# EasyEDA Pro project ProProject_Mini-Cube_2024-04-10.epro, board PCB2
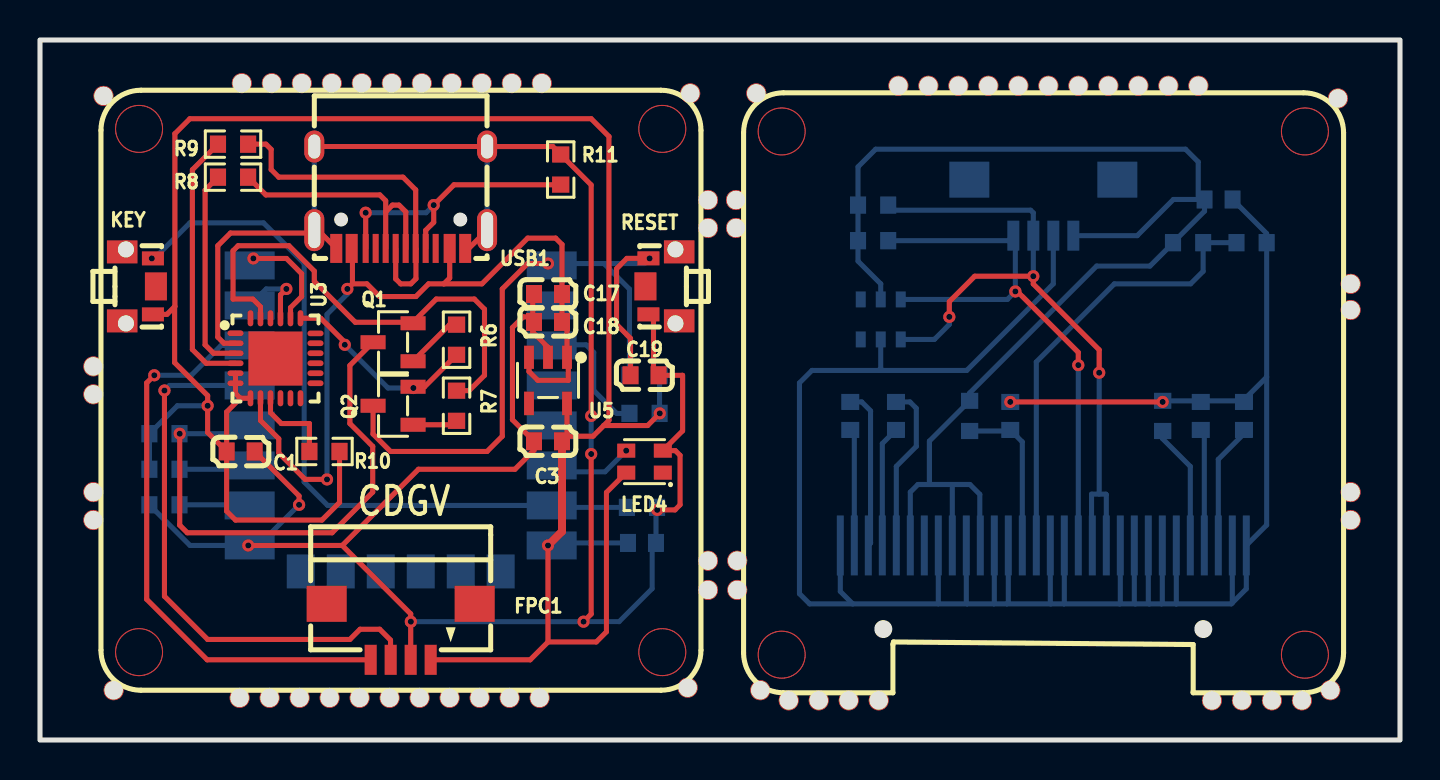
[diagram p3: board, top side]
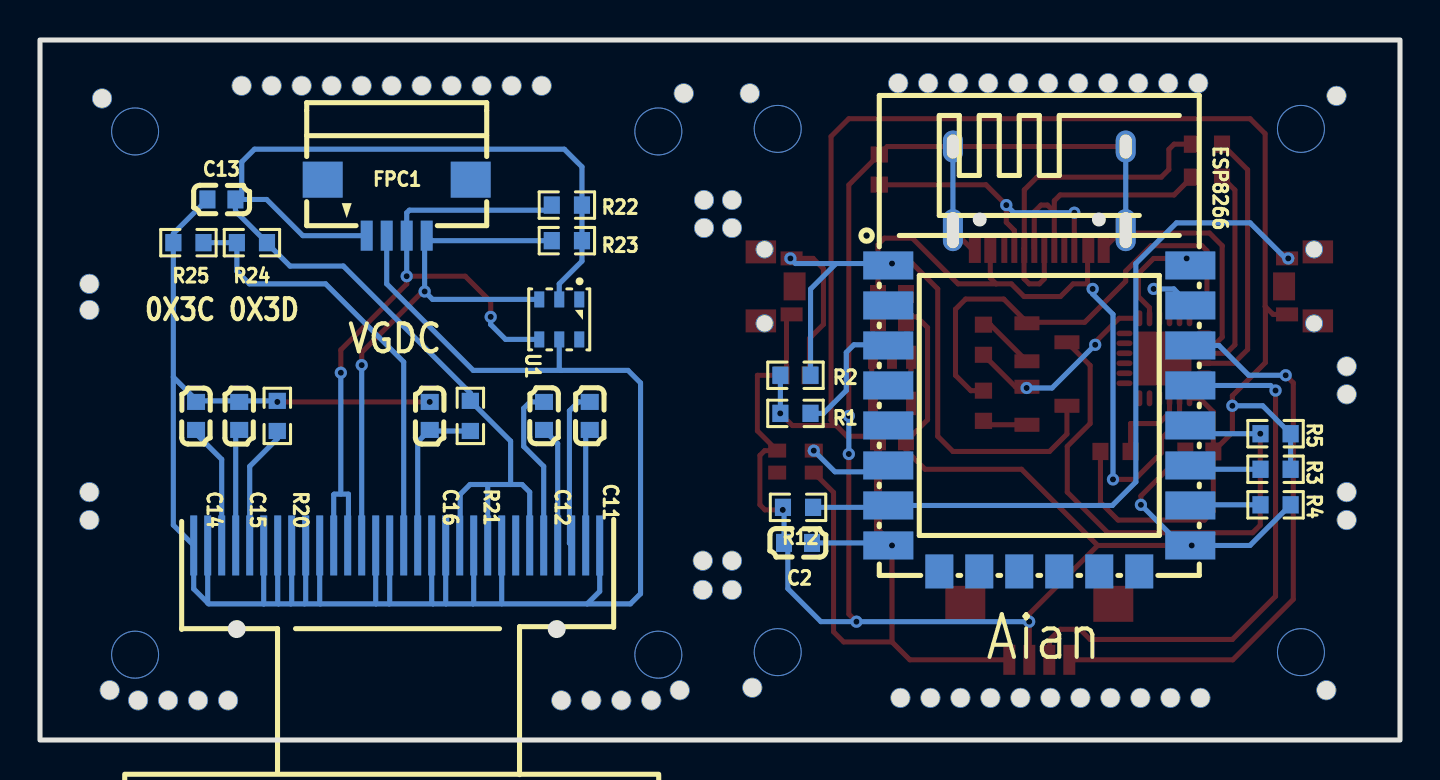
[diagram p4: board, bottom side, seen from below]

Outline 68 x 35 mm; copper layers: Top Layer, Bottom Layer. Coordinates in mm from the lower left corner of the outline.
Outline path: rectangle 0,35 68,0
Stack: Top Layer 0.035mm / Dielectric1 1.51mm FR4 er 4.5 / Bottom Layer 0.035mm

## Design rules (mm)
template: JLCPCB Capability(Two Layers Board)
spacing copperThickness1oz (default): track to track 0.102, other pairs 0.152 to 0.3
spacing copperThickness2oz: track to track 0.203, other pairs 0.152 to 0.3
track width copperThickness1oz (default): min 0.127, default 0.254, max 2.54
track width copperThickness2oz: min 0.203, default 0.254, max 2.54
differential pair differentialPair (default): width min 0.127, default 0.254, max 2.54; gap min 0.152, default 0.152
via viaSize (default): diameter min 0.5, default 0.61, max 10; hole min 0.3, default 0.305, max 6.3

## Placement (name value [footprint] x y rotation side)
C1  100nF  [C0603]  10.03 14.43 180 top
C2  100nF  [C0603]  30.1 9.85 180 bottom
C3  100nF  [C0603]  25.4 14.93 0 top
C11  100nF  [C0603]  40.51 16.2 270 bottom
C12  100nF  [C0603]  42.8 16.2 270 bottom
C13  100nF  [C0603]  58.93 27.03 0 bottom
C14  2.2UF  [C0603]  60.2 16.2 90 bottom
C15  4.7UF  [C0603]  58.04 16.2 90 bottom
C16  100nF  [C0603]  48.51 16.2 90 bottom
C17  100nF  [C0603]  25.4 22.3 0 top
C18  1UF  [C0603]  25.4 20.9 0 top
C19  100nF  [C0603]  30.23 18.24 0 top
ESP8266  2.4GHz  [WIFIM-SMD_ESP-12F-ESP8266MOD]  18.03 16.08 270 bottom
FPC1  -  [FFC-SMD_FFC10032-04SBB123W5M]  18.03 5.41 180 top
FPC1#2  -  [ffc-smd_ffc10032-04sbb123w5m]  50.17 26.62 0 bottom
KEY  GT-TC173C-H029-L1  [SW-SMD_GT-TC173A-H029-L1]  4.95 22.68 270 top
LED4  WS2812B-2020  [LED-SMD_4P-L2.0-W2.0-TL_WS2812B-2020]  30.23 13.92 180 top
NOREF  -  [Pad_e1829]  2.67 12.39 0 top
NOREF#2  -  [Pad_e1805]  33.4 7.5 0 top
NOREF#3  -  [Pad_e1843]  10.09 32.84 90 top
NOREF#4  -  [Pad_e1883]  21.98 2.11 90 top
NOREF#5  -  [Pad_e1844]  11.59 32.84 90 top
NOREF#6  -  [Pad_e1912]  3.68 2.49 90 top
NOREF#7  -  [Pad_e1861]  20.59 32.84 90 top
NOREF#8  -  [Pad_e1909]  37.44 1.98 90 top
NOREF#9  -  [Pad_e1908]  38.94 1.98 90 top
NOREF#10  -  [Pad_e1807]  34.86 8.97 0 top
NOREF#11  -  [Pad_e1833]  2.67 17.28 0 top
NOREF#12  -  [Pad_e1863]  42.92 32.71 90 top
NOREF#13  -  [Pad_e1872]  56.42 32.71 90 top
NOREF#14  -  [Pad_e1859]  17.59 32.84 90 top
NOREF#15  -  [Pad_e1834]  2.67 18.68 0 top
NOREF#16  -  [Pad_e1914]  32.51 32.33 90 top
NOREF#17  -  [Pad_e1873]  57.92 32.71 90 top
NOREF#18  -  [Pad_e1884]  23.48 2.11 90 top
NOREF#19  -  [Pad_e1879]  15.98 2.11 90 top
NOREF#20  -  [Pad_e1868]  50.42 32.71 90 top
NOREF#21  -  [Pad_e1915]  35.81 32.33 90 top
NOREF#22  -  [Pad_e1864]  44.42 32.71 90 top
NOREF#23  -  [Pad_e1905]  64.52 2.49 90 top
NOREF#24  -  [Pad_e1881]  18.98 2.11 90 top
NOREF#25  -  [Pad_e1795]  33.4 25.6 0 top
NOREF#26  -  [Pad_e1876]  11.48 2.11 90 top
NOREF#27  -  [Pad_e1860]  19.09 32.84 90 top
NOREF#28  -  [Pad_e1865]  45.92 32.71 90 top
NOREF#29  -  [Pad_e1875]  9.98 2.11 90 top
NOREF#30  -  [Pad_e1870]  53.42 32.71 90 top
NOREF#31  -  [Pad_e1904]  63.1 1.98 90 top
NOREF#32  -  [Pad_e1806]  34.86 7.5 0 top
NOREF#33  -  [Pad_e1846]  23.59 32.84 90 top
NOREF#34  -  [Pad_e1810]  65.53 21.5 0 top
NOREF#35  -  [Pad_e1882]  20.48 2.11 90 top
NOREF#36  -  [Pad_e1880]  17.48 2.11 90 top
NOREF#37  -  [Pad_e1866]  47.42 32.71 90 top
NOREF#38  -  [Pad_e1878]  14.48 2.11 90 top
NOREF#39  -  [Pad_e1910]  36.01 2.49 90 top
NOREF#40  -  [Pad_e1906]  41.94 1.98 90 top
NOREF#41  -  [Pad_e1856]  13.09 32.84 90 top
NOREF#42  -  [Pad_e1871]  54.92 32.71 90 top
NOREF#43  -  [Pad_e1901]  58.6 1.98 90 top
NOREF#44  -  [Pad_e1830]  2.67 11 0 top
NOREF#45  -  [Pad_e1869]  51.92 32.71 90 top
NOREF#46  -  [Pad_e1788]  34.8 27 0 top
NOREF#47  -  [Pad_e1903]  61.6 1.98 90 top
NOREF#48  -  [Pad_e1811]  65.53 11 0 top
NOREF#49  -  [Pad_e1867]  48.92 32.71 90 top
NOREF#50  -  [Pad_e1911]  32.39 2.61 90 top
NOREF#51  -  [Pad_e1789]  33.4 27 0 top
NOREF#52  -  [Pad_e1847]  25.09 32.84 90 top
NOREF#53  -  [Pad_e1877]  12.98 2.11 90 top
NOREF#54  -  [Pad_e1858]  16.09 32.84 90 top
NOREF#55  -  [Pad_e1885]  24.98 2.11 90 top
NOREF#56  -  [Pad_e1817]  65.53 12.39 0 top
NOREF#57  -  [Pad_e1808]  33.4 8.97 0 top
NOREF#58  -  [Pad_e1913]  64.9 32.08 90 top
NOREF#59  -  [Pad_e1907]  40.44 1.98 90 top
NOREF#60  -  [Pad_e1796]  34.8 25.6 0 top
NOREF#61  -  [Pad_e1916]  3.18 32.21 90 top
NOREF#62  -  [Pad_e1857]  14.59 32.84 90 top
NOREF#63  -  [Pad_e1809]  65.53 22.81 0 top
NOREF#64  -  [Pad_e1902]  60.1 1.98 90 top
NOREF#65  -  [Pad_e1862]  22.09 32.84 90 top
OLED1  VG-2864KSWEG01  [OLED_0.96-30P-P0.70-12864]  50.17 9.73 0 bottom
Q1  SS8050  [SOT-23-3_L2.9-W1.3-P1.90-LS2.4-BR]  17.65 19.89 0 top
Q2  SS8050  [SOT-23-3_L2.9-W1.3-P1.90-LS2.4-BR]  17.65 16.71 0 top
R1  10K  [R0603]  30.23 16.33 180 bottom
R2  10K  [R0603]  30.23 18.24 180 bottom
R3  10K  [R0603]  6.22 13.54 0 bottom
R4  10K  [R0603]  6.22 11.76 0 bottom
R5  10K  [R0603]  6.22 15.31 180 bottom
R6  1k  [R0603]  20.83 20.01 90 top
R7  1k  [R0603]  20.83 16.71 270 top
R8  220  [R0603]  9.65 28.14 180 top
R9  220  [R0603]  9.65 29.79 180 top
R10  4.7K  [R0603]  14.22 14.43 180 top
R11  5.1K  [R0603]  26.04 28.52 270 top
R12  10K  [R0603]  30.1 11.63 180 bottom
R20  910K  [R0603]  56.13 16.2 90 bottom
R21  4.7K  [R0603]  46.48 16.2 270 bottom
R22  10K  [R0603]  41.66 26.75 0 bottom
R23  10K  [R0603]  41.66 24.97 0 bottom
R24  10K  [R0603]  57.4 24.87 0 bottom
R25  10K  [R0603]  60.58 24.87 0 bottom
RESET  GT-TC173C-H029-L1  [SW-SMD_GT-TC173A-H029-L1]  31.11 22.68 90 top
U1  AHT20  [SENSOR-SMD_L3.0-W3.0-P1.00-BR]  42.04 21.03 90 bottom
U3  CP2104  [QFN-24_L4.0-W4.0-P0.50-BL-EP2.7]  11.77 19.09 270 top
U5  TPRT9013-33GB  [SOT-23-5_L3.0-W1.7-P0.95-LS2.8-BL]  25.4 17.98 180 top
USB1  TYPEC-304-BCP16  [USB-C-SMD_TYPEC-304-BCP16]  18.03 27.13 180 top

## Footprints (pads in the part's own frame, mm; a bottom-side part is the same pattern mirrored in y, then rotated)
C0603
  rect 0.8x0.9 smd: 1(-0.7,0) 2(0.7,0)
FFC-SMD_FFC10032-04SBB123W5M
  rect 0.6x1.5 smd: 1(-1.5,1.4) 2(-0.5,1.4) 3(0.5,1.4) 4(1.5,1.4)
  rect 2x1.8 smd: 5(3.7,-1.4) 6(-3.7,-1.4)
ffc-smd_ffc10032-04sbb123w5m
  rect 0.6x1.5 smd: 1(1.5,1.4) 2(0.5,1.4) 3(-0.5,1.4) 4(-1.5,1.4)
  rect 2x1.8 smd: 5(-3.7,-1.4) 6(3.7,-1.4)
LED-SMD_4P-L2.0-W2.0-TL_WS2812B-2020
  rect 0.9x0.7 smd: 1(-0.915,0.55) 2(-0.915,-0.55) 3(0.915,-0.55) 4(0.915,0.55)
OLED_0.96-30P-P0.70-12864
  rect 0.35x3 smd: 1(-10.15,0.003) 2(-9.45,0.001) 3(-8.75,0.001) 4(-8.05,0.001) 5(-7.35,0.001) 6(-6.65,0.001) 7(-5.95,0.001) 8(-5.25,0.001) 9(-4.55,0.001) 10(-3.85,0.001) 11(-3.15,0.001) 12(-2.45,0.001) 13(-1.75,0.001) 14(-1.05,0.001) 15(-0.35,0.001) 16(0.35,0.001) 17(1.05,0.001) 18(1.75,0.001) 19(2.45,0.001) 20(3.15,0.001) 21(3.85,0.001) 22(4.55,0.001) 23(5.25,0.001) 24(5.95,0.001) 25(6.65,0.001) 26(7.35,0.001) 27(8.05,0.001) 28(8.75,-0.002) 29(9.45,-0.003) 30(10.15,-0.003)
Pad_e1788
  round 1 hole 0.914: 1(0,0)
Pad_e1789
  round 1 hole 0.914: 2(0,0)
Pad_e1795
  round 1 hole 0.914: 2(0,0)
Pad_e1796
  round 1 hole 0.914: 1(0,0)
Pad_e1805
  round 1 hole 0.914: 2(0,0)
Pad_e1806
  round 1 hole 0.914: 1(0,0)
Pad_e1807
  round 1 hole 0.914: 1(0,0)
Pad_e1808
  round 1 hole 0.914: 2(0,0)
Pad_e1809
  round 1 hole 0.914: 1(0,0)
Pad_e1810
  round 1 hole 0.914: 2(0,0)
Pad_e1811
  round 1 hole 0.914: 3(0,0)
Pad_e1817
  round 1 hole 0.914: 3(0,0)
Pad_e1829
  round 1 hole 0.914: 3(0,0)
Pad_e1830
  round 1 hole 0.914: 3(0,0)
Pad_e1833
  round 1 hole 0.914: 3(0,0)
Pad_e1834
  round 1 hole 0.914: 3(0,0)
Pad_e1843
  round 1 hole 0.914: 1(0,0)
Pad_e1844
  round 1 hole 0.914: 2(0,0)
Pad_e1846
  round 1 hole 0.914: 3(0,0)
Pad_e1847
  round 1 hole 0.914: 3(0,0)
Pad_e1856
  round 1 hole 0.914: 2(0,0)
Pad_e1857
  round 1 hole 0.914: 1(0,0)
Pad_e1858
  round 1 hole 0.914: 2(0,0)
Pad_e1859
  round 1 hole 0.914: 2(0,0)
Pad_e1860
  round 1 hole 0.914: 1(0,0)
Pad_e1861
  round 1 hole 0.914: 2(0,0)
Pad_e1862
  round 1 hole 0.914: 2(0,0)
Pad_e1863
  round 1 hole 0.914: 1(0,0)
Pad_e1864
  round 1 hole 0.914: 2(0,0)
Pad_e1865
  round 1 hole 0.914: 2(0,0)
Pad_e1866
  round 1 hole 0.914: 1(0,0)
Pad_e1867
  round 1 hole 0.914: 2(0,0)
Pad_e1868
  round 1 hole 0.914: 2(0,0)
Pad_e1869
  round 1 hole 0.914: 1(0,0)
Pad_e1870
  round 1 hole 0.914: 2(0,0)
Pad_e1871
  round 1 hole 0.914: 2(0,0)
Pad_e1872
  round 1 hole 0.914: 3(0,0)
Pad_e1873
  round 1 hole 0.914: 3(0,0)
Pad_e1875
  round 1 hole 0.914: 1(0,0)
Pad_e1876
  round 1 hole 0.914: 2(0,0)
Pad_e1877
  round 1 hole 0.914: 2(0,0)
Pad_e1878
  round 1 hole 0.914: 1(0,0)
Pad_e1879
  round 1 hole 0.914: 2(0,0)
Pad_e1880
  round 1 hole 0.914: 2(0,0)
Pad_e1881
  round 1 hole 0.914: 1(0,0)
Pad_e1882
  round 1 hole 0.914: 2(0,0)
Pad_e1883
  round 1 hole 0.914: 2(0,0)
Pad_e1884
  round 1 hole 0.914: 3(0,0)
Pad_e1885
  round 1 hole 0.914: 3(0,0)
Pad_e1901
  round 1 hole 0.914: 1(0,0)
Pad_e1902
  round 1 hole 0.914: 2(0,0)
Pad_e1903
  round 1 hole 0.914: 2(0,0)
Pad_e1904
  round 1 hole 0.914: 1(0,0)
Pad_e1905
  round 1 hole 0.914: 2(0,0)
Pad_e1906
  round 1 hole 0.914: 1(0,0)
Pad_e1907
  round 1 hole 0.914: 2(0,0)
Pad_e1908
  round 1 hole 0.914: 2(0,0)
Pad_e1909
  round 1 hole 0.914: 1(0,0)
Pad_e1910
  round 1 hole 0.914: 2(0,0)
Pad_e1911
  round 1 hole 0.914: 2(0,0)
Pad_e1912
  round 1 hole 0.914: 1(0,0)
Pad_e1913
  round 1 hole 0.914: 3(0,0)
Pad_e1914
  round 1 hole 0.914: 3(0,0)
Pad_e1915
  round 1 hole 0.914: 3(0,0)
Pad_e1916
  round 1 hole 0.914: 3(0,0)
QFN-24_L4.0-W4.0-P0.50-BL-EP2.7
  oval 0.28x0.8 smd: 1(-1.25,-2) 2(-0.75,-2) 3(-0.25,-2) 4(0.25,-2) 5(0.75,-2) 6(1.25,-2) 13(1.25,2) 14(0.75,2) 15(0.25,2) 16(-0.25,2) 17(-0.75,2) 18(-1.242,2)
  oval 0.8x0.28 smd: 7(2,-1.25) 8(2,-0.75) 9(2,-0.25) 10(2,0.25) 11(2,0.75) 12(2,1.25) 19(-2,1.25) 20(-2,0.75) 21(-2,0.25) 22(-2,-0.25) 23(-2,-0.75) 24(-2,-1.25)
  rect 2.7x2.7 smd: 25(0.013,0)
R0603
  rect 0.806x0.864 smd: 1(-0.753,0) 2(0.753,0)
SENSOR-SMD_L3.0-W3.0-P1.00-BR
  rect 0.8x0.5 smd: 1(1,-1) 2(1,0) 3(1,1) 4(-1,1) 5(-1,0) 6(-1,-1)
SOT-23-3_L2.9-W1.3-P1.90-LS2.4-BR
  rect 1.25x0.7 smd: 1(1,-0.95) 2(1,0.95) 3(-1,0)
SOT-23-5_L3.0-W1.7-P0.95-LS2.8-BL
  rect 0.49x1.157 smd: 1(-0.95,-1.153) 2(0,-1.153) 3(0.95,-1.153)
  rect 0.49x1.175 smd: 4(0.95,1.153) 5(-0.95,1.153)
SW-SMD_GT-TC173A-H029-L1
  rect 0.7x1.1 smd: 1(-1.4,0.694) 2(1.4,0.694)
  rect 1.4x1.1 smd: 3(0,0.844)
  round 0.9 hole 0.8: 4(-1.85,-0.656) 4(1.85,-0.656)
  rect 1.15x1.524 smd: 4(-1.725,-0.844) 4(1.725,-0.844)
USB-C-SMD_TYPEC-304-BCP16
  oval 1x2.1 hole 0.6x1.8: 13(-4.32,1.633) 14(4.32,1.633)
  oval 1x1.6 hole 0.6x1.2: 15(-4.32,-2.547) 16(4.32,-2.547)
  rect 0.6x1.45 smd: A1B12(-3.225,2.547) A4B9(-2.45,2.547) B1A12(3.22,2.547) B4A9(2.45,2.547)
  rect 0.3x1.45 smd: A5(-1.25,2.547) A6(-0.25,2.547) A7(0.25,2.547) A8(1.25,2.547) B5(1.75,2.547) B6(0.75,2.547) B7(-0.75,2.547) B8(-1.75,2.547)
WIFIM-SMD_ESP-12F-ESP8266MOD
  rect 1.4x2.5 smd: 1(-7.651,-7.551) 2(-5.651,-7.551) 3(-3.651,-7.551) 4(-1.651,-7.551) 5(0.349,-7.551) 6(2.349,-7.551) 7(4.349,-7.551) 8(6.349,-7.551) 9(6.349,7.548) 10(4.349,7.55) 11(2.349,7.551) 12(0.349,7.551) 13(-1.651,7.55) 14(-3.651,7.551) 15(-5.651,7.551) 16(-7.651,7.551)
  rect 1.7x1.4 smd: 17(7.651,-5) 18(7.649,-3.002) 19(7.649,-1.004) 20(7.649,0.998) 21(7.649,2.997) 22(7.651,4.997)

## Nets
+5V: C17.2 C18.2 U3.8 U5.1 U5.3 USB1.A4B9 USB1.B4A9
GND: C1.1 C2.1 C3.1 C13.2 C14.2 C15.2 C16.2 C17.1 C18.1 C19.2 ESP8266.9 FPC1.2 FPC1#2.2 LED4.2 NOREF.3 NOREF#2.2 NOREF#3.1 NOREF#4.2 NOREF#5.2 NOREF#6.1 NOREF#7.2 NOREF#8.1 NOREF#9.2 NOREF#10.1 NOREF#11.3 NOREF#12.1 NOREF#13.3 NOREF#14.2 NOREF#15.3 NOREF#16.3 NOREF#17.3 NOREF#18.3 NOREF#19.2 NOREF#20.2 NOREF#21.3 NOREF#22.2 NOREF#23.2 NOREF#24.1 NOREF#25.2 NOREF#26.2 NOREF#27.1 NOREF#28.2 NOREF#29.1 NOREF#30.2 NOREF#31.1 NOREF#32.1 NOREF#33.3 NOREF#34.2 NOREF#35.2 NOREF#36.2 NOREF#37.1 NOREF#38.1 NOREF#39.2 NOREF#40.1 NOREF#41.2 NOREF#42.2 NOREF#43.1 NOREF#44.3 NOREF#45.1 NOREF#46.1 NOREF#47.2 NOREF#48.3 NOREF#49.2 NOREF#50.2 NOREF#51.2 NOREF#52.3 NOREF#53.2 NOREF#54.2 NOREF#55.3 NOREF#56.3 NOREF#57.2 NOREF#58.3 NOREF#59.2 NOREF#60.1 NOREF#61.3 NOREF#62.1 NOREF#63.1 NOREF#64.2 NOREF#65.2 OLED1.1 OLED1.8 OLED1.10 OLED1.12 OLED1.13 OLED1.16 OLED1.17 OLED1.21 OLED1.22 OLED1.23 OLED1.24 OLED1.25 OLED1.29 OLED1.30 R4.1 R11.1 R12.1 R20.2 R25.2 RESET.1 U1.5 U3.2 U5.2 USB1.13 USB1.14 USB1.15 USB1.16 USB1.A1B12 USB1.B1A12
VCC: C1.2 C2.2 C3.2 C13.1 ESP8266.8 FPC1.1 FPC1#2.1 KEY.2 LED4.4 OLED1.6 OLED1.9 OLED1.11 R1.1 R2.1 R3.1 R5.2 R10.1 R21.1 R22.1 R23.1 R24.1 U1.2 U3.5 U3.6 U3.7 U5.5
VCCOMH: C15.1 OLED1.27
DN: R9.1 USB1.A7 USB1.B7
DP: R8.1 USB1.A6 USB1.B6
DTR: Q1.2 R7.1 U3.23
ESP_RST: C19.1 ESP8266.1 Q2.3 R2.2 RESET.2
ESP_RX: ESP8266.15 U3.21
ESP_TX: ESP8266.16 U3.20
GPIO0: ESP8266.12 Q1.3 R5.1
IREF: OLED1.26 R20.1
KEY: ESP8266.7 KEY.1 R12.2
OLED_VCC: C14.1 OLED1.28
RTS: Q2.2 R6.1 U3.19
SA0: OLED1.15 R24.2 R25.1
SCL: ESP8266.14 FPC1.4 FPC1#2.4 OLED1.18 R23.2 U1.3
SDA: ESP8266.13 FPC1.3 FPC1#2.3 OLED1.19 OLED1.20 R22.2 U1.4
WS2812B: ESP8266.6 LED4.3
$1N382: ESP8266.10 R4.2
$1N385: ESP8266.11 R3.2
$1N388: ESP8266.3 R1.2
$1N424: C11.2 OLED1.2
$1N425: C12.2 OLED1.4
$1N426: C11.1 OLED1.3
$1N427: C12.1 OLED1.5
$1N447: C16.1 OLED1.14 R21.2
$1N764: Q2.1 R7.2
$1N765: Q1.1 R6.2
$1N803: R8.2 U3.3
$1N809: R9.2 U3.4
$1N935: R10.2 U3.9
$1N1200: R11.2 USB1.A5 USB1.B5

Pads without a net: ESP8266 2 4 5 17 18 19 20 21 22; FPC1 5 6; FPC1#2 5 6; KEY 3 4; LED4 1; OLED1 7; RESET 3 4; U1 1 6; U3 1 10 11 12 13 14 15 16 17 18 22 24 25; U5 4; USB1 A8 B8

## Via types
v1: diameter 2.4, hole 2.3, Top Layer to Bottom Layer, 8 vias
v2: diameter 0.61, hole 0.305, Top Layer to Bottom Layer, 32 vias

## Routing (per net, layer and track width the routed paths; a pad name or vN(x,y) marks a point on that pad's centre or on a via; arc(x,y) is an arc through that point)
+5V: length 41.9
  Top Layer w0.254: 20.19,22.81 19.43,22.81 18.8,22.17 16.98,22.17 16.34,22.81 15.62,22.81 ; 20.19,22.81 22.1,22.81 24.38,25.09 25.78,25.09 26.1,24.78 C17.2 C18.2 26.35,20.65 U5.1 26.42,19.07 26.42,17.98 24.89,17.98 24.45,18.42 U5.3 ; 20.19,22.81 20.48,23.1 USB1.A4B9 ; USB1.B4A9 15.62,24.54 15.62,22.81 ; 15.62,22.81 v2(15.37,22.55) ; U3.8 11.02,15.97 11.94,15.06 11.94,14.35 13.26,13.03 v2(14.35,13.03)
  Bottom Layer w0.254: v2(14.35,13.03) 14.35,21.28 15.37,22.3 v2(15.37,22.55)
GND: length 261.1
  Top Layer w0.25: v2(30.86,11.5) 31.75,11.5 32,11.76 32,14.23 31.77,14.47 LED4.2 32.13,15.46 32.13,18.24 C19.2 ; USB1.16 USB1.15 ; v2(12.95,11.76) 12.95,12.2 10.73,14.43 ; R11.1 27.56,27.75 v2(27.56,16.2) ; v2(27.56,14.3) 27.56,6.3
  Top Layer w0.254: 13.9,25.49 USB1.14 ; 13.9,25.49 USB1.B1A12 ; 13.9,25.49 13.75,25.35 9.53,25.35 8.89,24.71 8.89,20.14 9.2,19.84 U3.2 ; 18.53,5.92 18.53,6.31 15.11,9.73 ; 18.53,5.92 v2(18.54,5.92) ; 18.53,5.92 FPC1.2 ; 24.64,21.14 24.64,22.24 C17.1 ; 24.64,21.14 24.64,20.39 25.4,19.63 U5.2 ; 24.64,21.14 24.62,21.16 24.16,21.16 23.62,20.62 23.62,16.01 C3.1 24.7,14.49 23.75,13.54 18.92,13.54 15.11,9.73 ; 15.11,9.73 v2(10.41,9.73) ; USB1.A1B12 21.44,24.58 USB1.13 ; R11.1 25.64,29.67 USB1.15 ; C19.2 30.67,18.49 30.67,21.28 ; 27.56,6.3 v2(27.18,5.92) ; v2(48.51,16.9) v2(56.13,16.9)
  Bottom Layer w0.25: v2(30.86,11.5) 30.86,11.52 30.8,11.58 ; v2(12.95,11.76) 10.92,9.73 ESP8266.9 ; v2(27.56,16.2) v2(27.56,14.3) ; 30.8,11.58 C2.1 30.61,9.66 30.61,7.57 28.96,5.92 v2(27.18,5.92) ; 30.8,11.58 R12.1
  Bottom Layer w0.254: 50.54,6.81 51.2,6.81 ; 50.54,6.81 50.52,6.83 OLED1.16 ; 50.54,6.81 48.35,6.81 ; 51.2,6.81 53.98,6.81 ; 51.2,6.81 51.22,6.82 OLED1.17 ; OLED1.13 48.42,6.88 48.35,6.81 ; R4.1 7.5,9.73 v2(10.41,9.73) ESP8266.9 ; 46.36,6.81 46.32,6.85 OLED1.10 ; 46.36,6.81 40.64,6.81 ; 46.36,6.81 47.7,6.81 ; 48.35,6.81 47.7,6.81 ; U1.5 42.04,18.57 41.95,18.48 ; 54.77,6.81 55.46,6.81 ; 54.77,6.81 53.98,6.81 ; 54.77,6.81 54.72,6.86 OLED1.22 ; 55.46,6.81 56.07,6.81 ; 55.46,6.81 55.42,6.85 OLED1.23 ; 61.33,18.14 60.14,16.96 ; 61.33,18.14 R25.2 61.33,25.32 C13.2 ; 61.33,18.14 61.33,10.75 OLED1.30 60.32,7.56 59.61,6.86 ; 60.14,16.96 R20.2 v2(56.13,16.9) ; 60.14,16.96 C14.2 ; v2(27.18,5.92) v2(18.54,5.92) ; 53.98,6.81 54.02,6.84 OLED1.21 ; OLED1.25 56.82,6.81 56.81,6.81 ; OLED1.8 44.92,6.81 ; 41.95,18.48 46.34,18.48 50.67,22.81 FPC1#2.2 ; 41.95,18.48 38.6,18.48 37.97,17.86 37.97,7.31 38.48,6.81 40.64,6.81 ; USB1.15 USB1.13 ; OLED1.12 47.72,6.83 47.7,6.81 ; 56.07,6.81 56.11,6.85 OLED1.24 ; 56.07,6.81 56.81,6.81 ; 59.61,6.86 OLED1.29 ; 59.61,6.86 59.56,6.81 56.81,6.81 ; 40.64,6.81 40.02,7.43 OLED1.1 ; USB1.14 USB1.16
VCC: length 185.8
  Top Layer w0.25: LED4.4 28.32,12.38 28.32,5.41 27.81,4.9 25.4,4.9
  Top Layer w0.254: C1.2 8.38,15.38 v2(8.38,16.71) 8.38,17.22 6.73,18.87 6.73,21.66 ; C1.2 9.33,11.44 9.78,11 14.1,11 14.98,11.88 R10.1 ; C1.2 9.33,16.4 10.02,17.09 ; 10.02,17.09 U3.7 ; 10.02,17.09 9.77,17.33 U3.6 U3.5 ; v2(25.4,9.73) 25.4,4.9 24.51,4.01 FPC1.1 ; 28.19,15.72 28.45,15.98 28.45,30.17 27.56,31.06 7.49,31.06 6.74,30.31 6.74,21.68 6.73,21.66 ; 28.19,15.72 27.65,15.19 26.35,15.19 26.35,15.18 ; 28.19,15.72 30.38,15.72 v2(30.99,16.33) ; 6.73,21.66 6.35,21.28 5.52,21.28 ; 26.35,15.18 C3.2 ; 26.35,15.18 U5.5
  Top Layer w0.4: C3.2 26.1,10.43 v2(25.4,9.73)
  Bottom Layer w0.254: 58,27.03 56.67,27.03 54.86,25.22 FPC1#2.1 ; 58,27.03 C13.1 58.23,26.44 R24.1 56.65,24.85 55.5,23.7 52.83,23.7 46.48,17.35 R21.1 44.47,14.95 44.47,12.78 ; 58,27.03 57.91,27.11 57.91,28.9 57.28,29.54 41.78,29.54 40.9,28.66 R22.1 R23.1 40.9,23.94 42.04,22.81 U1.2 ; OLED1.11 46.99,9.75 46.99,12.28 46.5,12.78 45.65,12.78 ; 44.47,12.78 45.65,12.78 ; 44.47,12.78 43.9,12.78 43.52,12.39 OLED1.6 ; 45.65,12.78 45.61,12.74 OLED1.9 ; v2(30.99,16.33) R1.1 R2.1 ; v2(25.4,9.73) ESP8266.8 25.71,9.85 C2.2 ; v2(8.38,16.71) 6.87,16.71 R5.2 R3.1
VCCOMH: length 5.9
  Bottom Layer w0.254: OLED1.27 58.22,15.33 C15.1
(no net):
  vias: v1(4.95,30.55) v1(4.95,4.39) v1(31.11,30.55) v1(31.11,4.39) v1(37.08,30.43) v1(37.08,4.27) v1(63.25,30.43) v1(63.25,4.27)
DN: length 17.1
  Top Layer w0.254: USB1.A7 17.78,23.06 18.03,22.81 18.54,22.81 18.8,23.06 18.8,24.57 USB1.B7 18.78,27.51 18.15,28.14 11.94,28.14 11.56,28.52 11.56,29.53 11.29,29.79 R9.1
DP: length 12.9
  Top Layer w0.254: 17.28,26.4 17.62,26.75 17.95,26.75 18.29,26.41 18.29,24.58 USB1.A6 ; 17.28,26.4 17.28,26.96 16.99,27.25 11.29,27.25 R8.1 ; 17.28,26.4 USB1.B6
DTR: length 24.8
  Top Layer w0.254: U3.23 11.02,21.66 10.64,22.05 9.65,22.05 9.65,24.46 9.91,24.71 12.45,24.71 13.72,23.44 13.72,22.94 15.76,20.89 18.65,20.89 ; 18.65,20.89 Q1.2 ; 18.65,20.89 19.81,22.05 21.72,22.05 22.23,21.54 22.23,18.24 21.45,17.47 R7.1
ESP_RST: length 37.8
  Top Layer w0.254: 30.48,24.08 29.35,24.08 28.83,23.56 28.83,20.78 29.53,20.08 C19.1 ; 30.48,24.08 v2(30.48,24.08) ; 30.48,24.08 30.67,24.08 ; Q2.3 16.65,15.3 17.53,14.43 22.35,14.43 23.11,15.19 23.11,22.55 24.38,23.82 v2(25.4,23.82)
  Bottom Layer w0.254: 28.19,23.82 29.47,22.55 R2.2 ; 28.19,23.82 30.23,23.82 v2(30.48,24.08) ; 28.19,23.82 25.49,23.82 ; 25.49,23.82 v2(25.4,23.82) ; 25.49,23.82 ESP8266.1
ESP_RX: length 3.8
  Top Layer w0.254: U3.21 12.02,22.26 v2(12.32,22.55)
  Bottom Layer w0.254: v2(12.32,22.55) 11.31,22.55 ESP8266.15
ESP_TX: length 5.6
  Top Layer w0.254: U3.20 12.52,21.62 13.08,22.17 13.08,23.32 12.32,24.08 v2(10.67,24.08)
  Bottom Layer w0.254: v2(10.67,24.08) 10.67,23.91 ESP8266.16
GPIO0: length 27.3
  Top Layer w0.254: Q1.3 15.49,18.73 15.49,15.82 16.64,14.68 16.64,12.39 14.61,10.36 7.37,10.36 6.98,10.74 v2(6.98,15.31)
  Bottom Layer w0.254: R5.1 v2(6.98,15.31) 10.07,15.31 ESP8266.12
IREF: length 6.3
  Bottom Layer w0.254: OLED1.26 57.52,13.68 56.13,15.06 R20.1
KEY: length 36.9
  Top Layer w0.254: v2(5.59,24.08) 5.52,24.08 5.52,24.08
  Bottom Layer w0.25: R12.2 25.68,11.63 ESP8266.7
  Bottom Layer w0.254: v2(5.59,24.08) 5.72,24.08 7.49,25.86 11.18,25.86 13.21,23.82 13.21,12.9 14.38,11.73 ESP8266.7
OLED_VCC: length 6.3
  Bottom Layer w0.254: C14.1 60.2,15.31 58.92,14.03 OLED1.28
RTS: length 10.1
  Top Layer w0.254: v2(18.67,17.6) 18.67,17.65 Q2.2 19.23,17.66 R6.1 ; v2(15.24,19.76) 15.24,19.89 14.04,21.09 U3.19
  Bottom Layer w0.254: v2(15.24,19.76) 17.4,17.6 v2(18.67,17.6)
SA0: length 22.5
  Bottom Layer w0.254: R25.1 R24.2 58.16,23.43 57.53,22.81 53.72,22.81 49.82,18.9 OLED1.15
SCL: length 58.3
  Top Layer w0.254: FPC1.4 8.36,4.01 5.33,7.04 5.33,17.86 v2(5.72,18.24) ; v2(51.92,18.74) 51.92,19.38 48.87,22.43 v2(48.77,22.43)
  Bottom Layer w0.254: U1.3 48.37,22.03 v2(48.77,22.43) 48.77,25.11 FPC1#2.4 48.41,24.97 R23.2 ; ESP8266.14 9.06,19.73 7.56,18.24 v2(5.72,18.24) ; OLED1.18 v2(51.92,18.74)
SDA: length 65.6
  Top Layer w0.254: v2(45.47,21.16) 45.47,21.92 46.74,23.19 v2(49.67,23.19) 49.67,22.8 52.96,19.51 v2(52.96,18.36) ; FPC1.3 17.53,4.02 17.53,5 16.99,5.54 16,5.54 15.49,5.03 8.38,5.03 6.22,7.19 v2(6.22,17.47)
  Bottom Layer w0.254: v2(45.47,21.16) 45.47,20.78 44.72,20.03 U1.4 ; OLED1.19 52.58,9.76 52.58,12.29 53.29,12.29 53.32,12.27 OLED1.20 ; R22.2 42.66,26.49 49.53,26.49 49.67,26.36 FPC1#2.3 v2(49.67,23.19) ; v2(6.22,17.47) 6.48,17.73 ESP8266.13 ; v2(52.96,18.36) 52.96,12.29
WS2812B: length 4.3
  Bottom Layer w0.25: ESP8266.6 25.9,13.41 28.25,13.41 v2(29.31,14.47)
$1N382: length 3.5
  Bottom Layer w0.254: ESP8266.10 10.45,11.76 R4.2
$1N385: length 3.6
  Bottom Layer w0.254: R3.2 10.29,13.54 ESP8266.11
$1N388: length 6.4
  Bottom Layer w0.254: R1.2 28.83,16.33 27.69,17.47 27.69,19.38 27.3,19.76 25.62,19.76 ESP8266.3
$1N424: length 5.9
  Bottom Layer w0.254: OLED1.2 40.72,15.3 C11.2
$1N425: length 6.1
  Bottom Layer w0.254: OLED1.4 42.11,14.82 C12.2
$1N426: length 8
  Bottom Layer w0.254: C11.1 41.08,16.9 41.53,16.46 41.53,9.84 OLED1.3
$1N427: length 8.4
  Bottom Layer w0.254: OLED1.5 42.82,13.68 43.82,14.68 43.82,16.58 43.5,16.9 C12.1
$1N447: length 8.1
  Bottom Layer w0.254: OLED1.14 49.11,14.9 C16.1 48.46,15.45 R21.2
$1N764: length 2.3
  Top Layer w0.254: Q2.1 20.63,15.76 R7.2
$1N765: length 2.9
  Top Layer w0.254: R6.2 20.48,20.77 Q1.1
$1N803: length 10.3
  Top Layer w0.254: U3.3 8.68,19.34 8.26,19.76 8.26,27.5 R8.2
$1N809: length 13.2
  Top Layer w0.254: U3.4 8.31,18.84 7.62,19.52 7.62,28.51 R9.2
$1N935: length 4.3
  Top Layer w0.254: U3.9 11.52,16.36 12.07,15.82 13.47,15.82 R10.2
$1N1200: length 14.5
  Top Layer w0.254: USB1.A5 19.28,25.48 19.69,25.88 v2(19.69,26.75) 20.7,27.76 26.03,27.76 R11.2 ; USB1.B5 v2(16.28,26.36)
  Bottom Layer w0.254: v2(19.69,26.75) 19.3,26.36 v2(16.28,26.36)

## Copper pours and planes (outline as drawn; the poured copper is in the pictures)
GND on Top Layer: -8,43 87.5,43 87.5,-5.26 -8,-5.26
GND on Bottom Layer: -18.03,52.78 101.47,52.78 101.47,-9.7 -18.03,-9.7

## Text on the board
Bottom Silkscreen Layer: 0X3C | 0X3D | VGDC | Aian
Top Silkscreen Layer: CDGV
